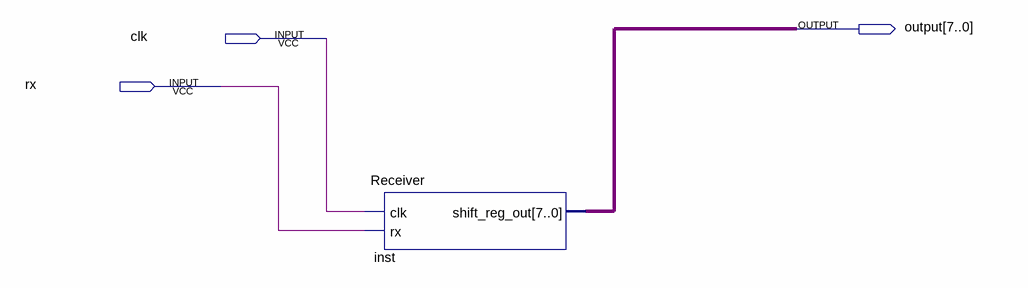
[diagram p0: schematic sheet]
// Quartus schematic Receiver_test.bdf as structural Verilog: 1 symbols, 3 pins
module Receiver_test (
  input  clk,
  input  rx,
  output [7:0] \output 
);

  Receiver inst (.clk(clk), .rx(rx), .shift_reg_out(\output ));
endmodule
